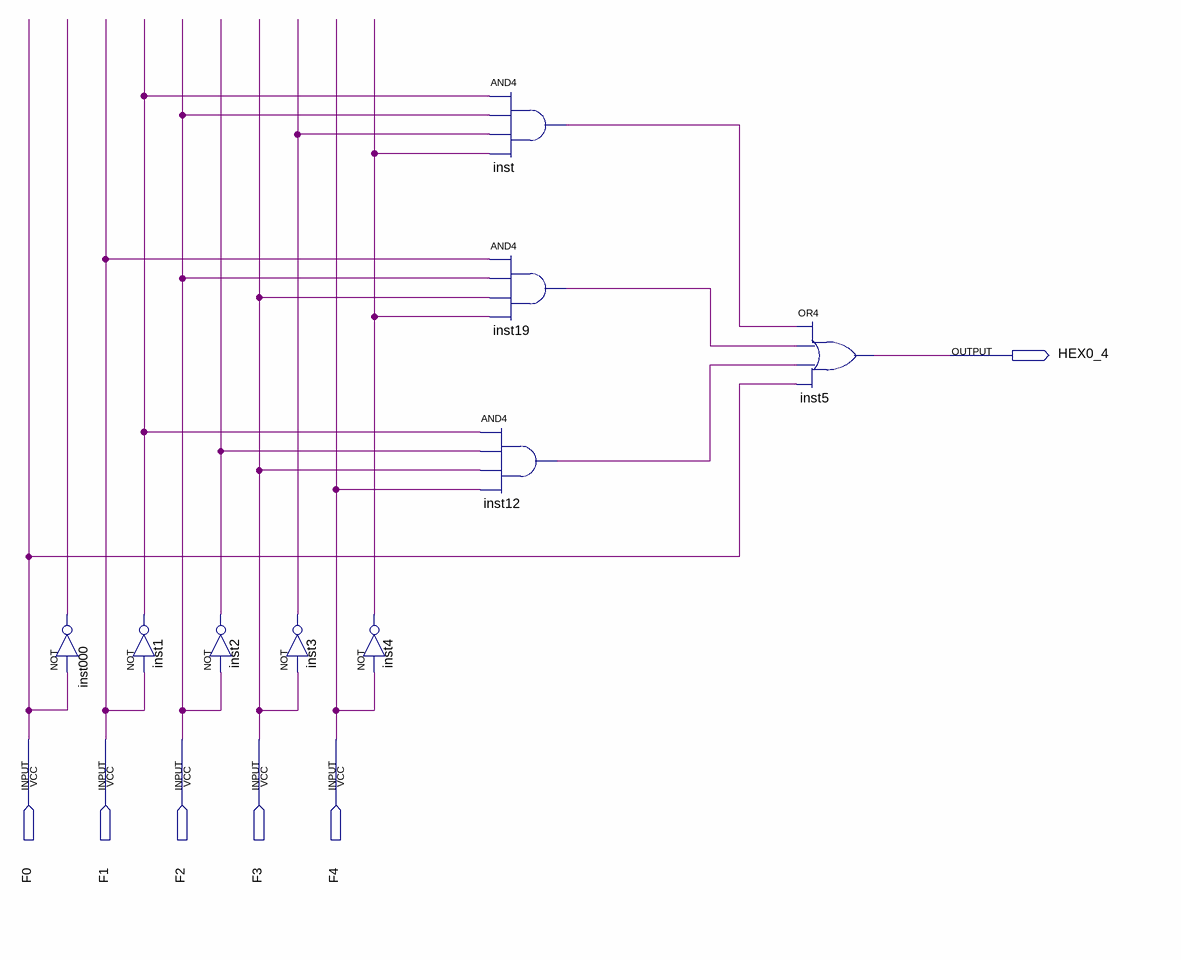
[diagram p0: schematic sheet]
// Quartus schematic HEX04.bdf as structural Verilog: 9 symbols, 6 pins
module HEX04 (
  input  F0,
  input  F1,
  input  F2,
  input  F3,
  input  F4,
  output HEX0_4
);

  wire inst000_out, inst1_out, inst2_out, inst3_out, inst4_out, inst12_out, inst19_out, inst_out;

  not inst000 (inst000_out, F0);
  not inst1 (inst1_out, F1);
  not inst2 (inst2_out, F2);
  not inst3 (inst3_out, F3);
  not inst4 (inst4_out, F4);
  and inst (inst_out, inst1_out, F2, inst3_out, inst4_out);
  and inst19 (inst19_out, F1, F2, F3, inst4_out);
  and inst12 (inst12_out, inst1_out, inst2_out, F3, F4);
  or inst5 (HEX0_4, inst_out, inst19_out, inst12_out, F0);
endmodule
